# Altium schematic sheet monitoring.SchDoc: Fault-Tolerant Quadcopter
size A; DrawnBy: Vaughn Kottler; Engineer: Vaughn Kottler; Revision: A
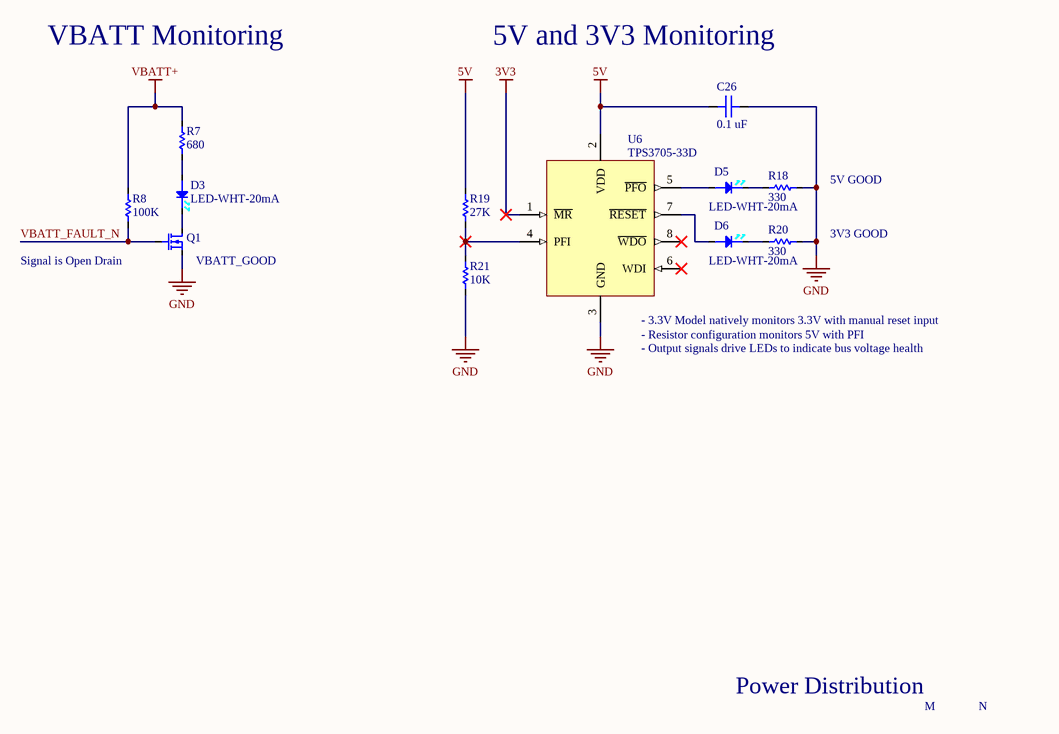
[diagram p0: monitoring.SchDoc]

## Parts
C26  0.1 uF  [CAP-CER-0805-SHORT]
D3  LED-WHT-20mA  [LED-0805]
D5  LED-WHT-20mA  [LED-0805]
D6  LED-WHT-20mA  [LED-0805]
Q1  2N7002K  [SOT-23-3]  (value not drawn)
R7  680  [RES-0805]
R8  100K  [RES-0805]
R18  330  [RES-0805]
R19  27K  [RES-0805]
R20  330  [RES-0805]
R21  10K  [RES-0805]
U6  Manufacturer Part Number: TPS3705-33D  [8SOIC]  (hidden comment: IC_TPS3705-33DGN.1)

## Nets
3V3: U6.1(~{MR})
5V: C26.1 R19.2 U6.2(VDD)
GND: C26.2 Q1.2(S) R18.2 R20.2 R21.1 U6.3(GND)
VBATT+: R7.2 R8.2
VBATT_FAULT_N: Q1.1(G) R8.1
NetD3_1: D3.1(CT) R7.1
NetD3_2: D3.2(AN) Q1.3(D)
NetD5_1: D5.1(CT) U6.5(~{PFO})
NetD5_2: D5.2(AN) R18.1
NetD6_1: D6.1(CT) U6.7(~{RESET})
NetD6_2: D6.2(AN) R20.1
NetR19_1: R19.1 R21.2 U6.4(PFI)

Not connected (* = marked no-connect by the designer): U6 6(WDI)* 8(~{WDO})*

## Notes on the sheet
- VBATT Monitoring
- 5V and 3V3 Monitoring
- (near R18) 5V GOOD
- 3V3 GOOD
- Signal is Open Drain
- (near Q1) VBATT_GOOD
- (near U6) - 3.3V Model natively monitors 3.3V with manual reset input
- (near U6) - Resistor configuration monitors 5V with PFI
- (near U6) - Output signals drive LEDs to indicate bus voltage health
- Power Distribution
- M
- N

## Library data of the parts
C26 = CAP-CER-0.1uF-25V: 10%, 0805; ComponentLink1Description: Capacitor Book (Amazon); ComponentLink1URL: https://www.amazon.com/gp/product/B0728HBDRW/
D3 D5 D6 = LED-WHT-20mA: 2.2V, 0805; ComponentLink1Description: Resistor Book (Amazon); ComponentLink1URL: https://www.amazon.com/gp/product/B071J21FYF/; Supplier 1: Digi-Key; Supplier Part Number 1: 475-1410-1-ND
Q1 = NMOS-2.0VT-60VDS-300mA: N-Channel, SOT-23; ComponentLink1Description: Datasheet; ComponentLink1URL: https://www.rohm.com/datasheet/RE1C002UN/re1c002untcl-e; Supplier 1: Digi-Key; Supplier Part Number 1: 2N7002K-T1-E3DKR-ND
R7 = RES-680-1/8W: 0805; ComponentLink1Description: Resistor Book (Amazon); ComponentLink1URL: https://www.amazon.com/gp/product/B071J21FYF/
R8 = RES-100K-1/8W: 0805; ComponentLink1Description: Resistor Book (Amazon); ComponentLink1URL: https://www.amazon.com/gp/product/B071J21FYF/
R18 R20 = RES-330-1/8W: 0805; ComponentLink1Description: Resistor Book (Amazon); ComponentLink1URL: https://www.amazon.com/gp/product/B071J21FYF/
R19 = RES-27K-1/8W: 0805; ComponentLink1Description: Resistor Book (Amazon); ComponentLink1URL: https://www.amazon.com/gp/product/B071J21FYF/
R21 = RES-10K-1/8W: 0805; ComponentLink1Description: Resistor Book (Amazon); ComponentLink1URL: https://www.amazon.com/gp/product/B071J21FYF/
U6 = IC_TPS3705-33DGN.1: IC 2.93V PROCESSOR MONITOR 8MSOP; Manufacturer: Texas Instruments; Number of Voltages Monitored: 1; Output: Push-Pull, Totem Pole; Reset: Active Low; Reset Timeout: 140 ms Minimum; Supplier 1: Digi-Key; RoHS: RoHS Compliant; Category: Integrated Circuits (ICs); Stock 1: 1844; Pricing 1: 1=2.04, 10=1.831, 100=1.4718, 500=1.20926, 1000=1.00195, 2500=0.93285, 5000=0.8983, 10000=0.86375 (USD); Packaging: Tube; Part Status: Active; Type: Simple Reset/Power-On Reset; Voltage - Threshold: 2.93V; Operating Temperature: -40°C ~ 85°C (TA); Mounting Type: Surface Mount; Package / Case: 8-SOIC (0.154", 3.90mm Width); Supplier Device Package: 8-SOIC; ComponentLink1URL: http://www.ti.com/lit/ds/symlink/tps3705.pdf; ComponentLink1Description: Datasheet; Supplier Part Number 1: 296-2623-5-ND